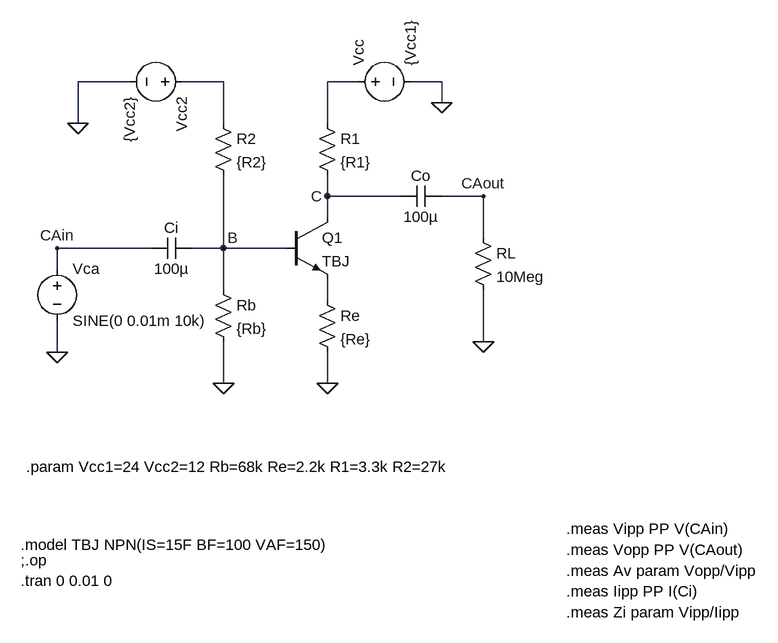
[diagram p0: schematic LISTA02Q02.asc]
LISTA02Q02.asc, the LTspice schematic file:
Version 4
SHEET 1 1656 1300
WIRE -16 0 -96 0
WIRE 128 0 64 0
WIRE 336 0 288 0
WIRE 464 0 416 0
WIRE 464 32 464 0
WIRE -96 64 -96 0
WIRE 128 64 128 0
WIRE 288 64 288 0
WIRE 288 176 288 144
WIRE 400 176 288 176
WIRE 528 176 464 176
WIRE 288 208 288 176
WIRE 528 240 528 176
WIRE 16 256 -128 256
WIRE 128 256 128 144
WIRE 128 256 80 256
WIRE 224 256 128 256
WIRE -128 288 -128 256
WIRE 128 320 128 256
WIRE 288 336 288 304
WIRE 528 400 528 320
WIRE -128 416 -128 368
WIRE 128 464 128 400
WIRE 288 464 288 416
FLAG 464 32 0
FLAG 288 464 0
FLAG -128 416 0
FLAG -128 256 CAin
FLAG 528 400 0
FLAG 528 176 CAout
FLAG 128 256 B
FLAG 288 176 C
FLAG 128 464 0
FLAG -96 64 0
SYMBOL res 112 304 R0
SYMATTR InstName Rb
SYMATTR Value {Rb}
SYMBOL res 272 48 R0
SYMATTR InstName R1
SYMATTR Value {R1}
SYMBOL voltage 320 0 R270
WINDOW 123 0 0 Left 0
WINDOW 39 0 0 Left 0
SYMATTR InstName Vcc
SYMATTR Value {Vcc1}
SYMBOL npn 224 208 R0
SYMATTR InstName Q1
SYMATTR Value TBJ
SYMBOL cap 80 240 R90
WINDOW 0 0 32 VBottom 2
WINDOW 3 32 32 VTop 2
SYMATTR InstName Ci
SYMATTR Value 100µ
SYMBOL cap 464 160 R90
WINDOW 0 0 32 VBottom 2
WINDOW 3 32 32 VTop 2
SYMATTR InstName Co
SYMATTR Value 100µ
SYMBOL voltage -128 272 R0
WINDOW 123 0 0 Left 0
WINDOW 39 0 0 Left 0
SYMATTR InstName Vca
SYMATTR Value SINE(0 0.01m 10k)
SYMBOL res 512 224 R0
SYMATTR InstName RL
SYMATTR Value 10Meg
SYMBOL res 272 320 R0
SYMATTR InstName Re
SYMATTR Value {Re}
SYMBOL voltage 80 0 R90
WINDOW 123 0 0 Left 0
WINDOW 39 0 0 Left 0
SYMATTR InstName Vcc2
SYMATTR Value {Vcc2}
SYMBOL res 112 48 R0
SYMATTR InstName R2
SYMATTR Value {R2}
TEXT -184 768 Left 2 !.tran 0 0.01 0
TEXT -176 592 Left 2 !.param Vcc1=24 Vcc2=12 Rb=68k Re=2.2k R1=3.3k R2=27k
TEXT -184 712 Left 2 !.model TBJ NPN(IS=15F BF=100 VAF=150)
TEXT 656 688 Left 2 !.meas Vipp PP V(CAin)
TEXT 656 784 Left 2 !.meas Iipp PP I(Ci)
TEXT 656 816 Left 2 !.meas Zi param Vipp/Iipp
TEXT 656 720 Left 2 !.meas Vopp PP V(CAout)
TEXT 656 752 Left 2 !.meas Av param Vopp/Vipp
TEXT -184 736 Left 2 !;.op

The netlist it stands for:
* LISTA02Q02.asc
Rb B 0 {Rb}
R1 N002 C {R1}
Vcc N002 0 {Vcc1}
Q1 C B N003 0 TBJ
Ci B CAin 100µ
Co CAout C 100µ
Vca CAin 0 SINE(0 0.01m 10k)
RL CAout 0 10Meg
Re N003 0 {Re}
Vcc2 N001 0 {Vcc2}
R2 N001 B {R2}
.model NPN NPN
.model PNP PNP
.lib standard.bjt
.tran 0 0.01 0
.param Vcc1=24 Vcc2=12 Rb=68k Re=2.2k R1=3.3k R2=27k
.model TBJ NPN(IS=15F BF=100 VAF=150)
.meas Vipp PP V(CAin)
.meas Iipp PP I(Ci)
.meas Zi param Vipp/Iipp
.meas Vopp PP V(CAout)
.meas Av param Vopp/Vipp
;.op
.backanno
.end